# Altium schematic sheet drive-mp1907.SchDoc
size A3
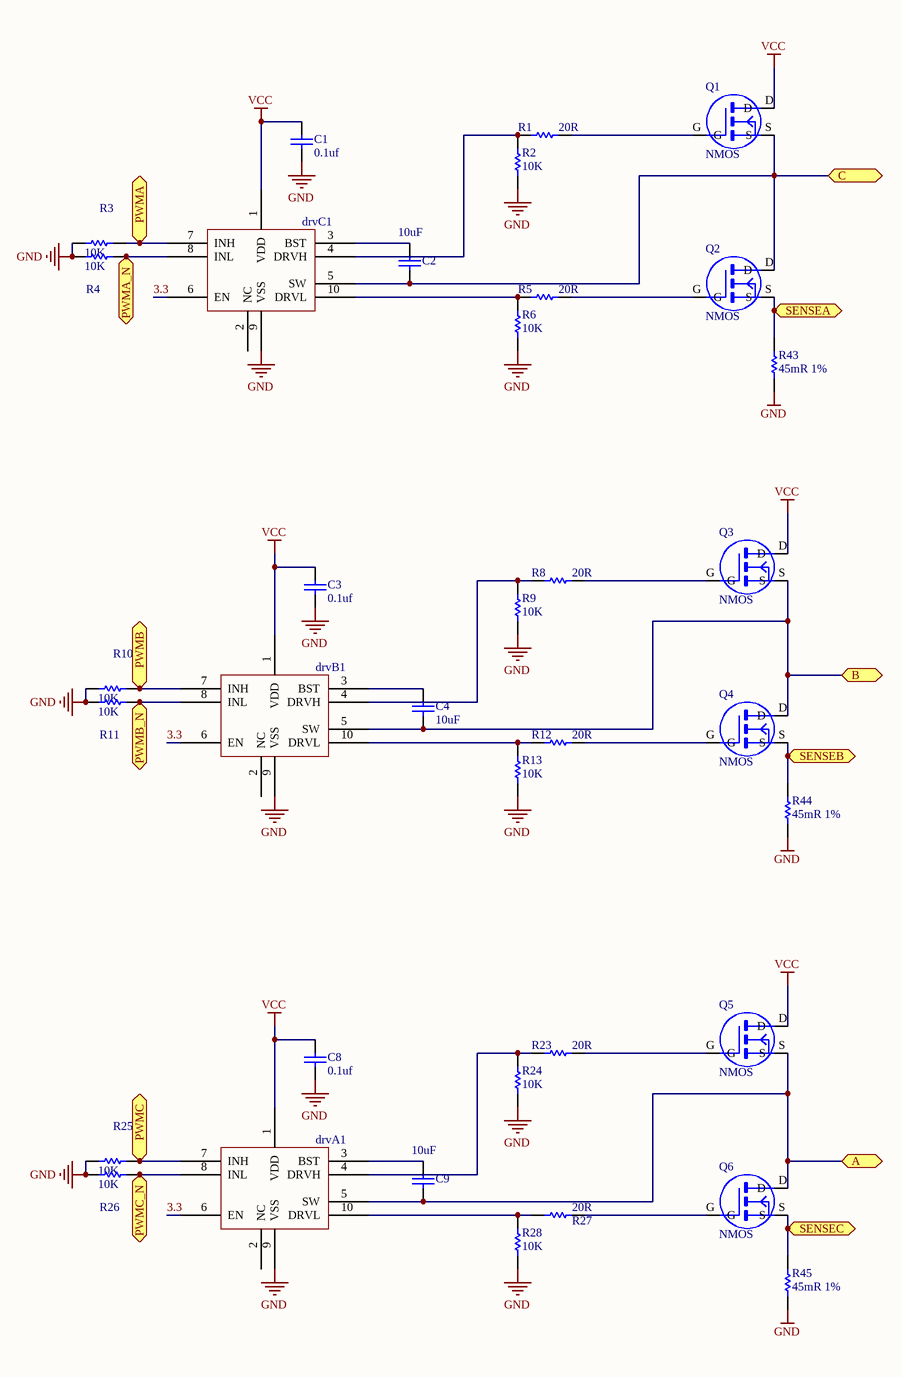
[diagram p0: drive-mp1907.SchDoc]

## Parts
C1  value 0.1uf  [0603]  (hidden comment: Cap)
C2  10uF  [0805]
C3  value 0.1uf  [0603]  (hidden comment: Cap)
C4  value 10uF  [0805]  (hidden comment: Cap)
C8  value 0.1uf  [0603]  (hidden comment: Cap)
C9  10uF  [0805]
drvA1  MP1907  [MP1907]  (value not drawn)
drvB1  MP1907  [MP1907]  (value not drawn)
drvC1  MP1907  [MP1907]  (value not drawn)
Q1  NMOS  [BSC025N03MS]
Q2  NMOS  [BSC025N03MS]
Q3  NMOS  [BSC025N03MS]
Q4  NMOS  [BSC025N03MS]
Q5  NMOS  [BSC025N03MS]
Q6  NMOS  [BSC025N03MS]
R1  value 20R  [0603]  (hidden comment: Res1)
R2  value 10K  [0603]  (hidden comment: Res1)
R3  value 10K  [0603]  (hidden comment: Res1)
R4  value 10K  [0603]  (hidden comment: Res1)
R5  value 20R  [0603]  (hidden comment: Res1)
R6  value 10K  [0603]  (hidden comment: Res1)
R8  value 20R  [0603]  (hidden comment: Res1)
R9  value 10K  [0603]  (hidden comment: Res1)
R10  value 10K  [0603]  (hidden comment: Res1)
R11  value 10K  [0603]  (hidden comment: Res1)
R12  value 20R  [0603]  (hidden comment: Res1)
R13  value 10K  [0603]  (hidden comment: Res1)
R23  value 20R  [0603]  (hidden comment: Res1)
R24  value 10K  [0603]  (hidden comment: Res1)
R25  value 10K  [0603]  (hidden comment: Res1)
R26  value 10K  [0603]  (hidden comment: Res1)
R27  value 20R  [0603]  (hidden comment: Res1)
R28  value 10K  [0603]  (hidden comment: Res1)
R43  45mR 1%  [2512]
R44  45mR 1%  [2512]
R45  45mR 1%  [2512]

## Ports
A, B, C, PWMA, PWMA_N, PWMB, PWMB_N, PWMC, PWMC_N, SENSEA, SENSEB, SENSEC

## Nets
GND: C1.2 C3.2 C8.2 drvA1.9(VSS) drvB1.9(VSS) drvC1.9(VSS) R2.2 R3.2 R4.2 R6.2 R9.2 R10.2 R11.2 R13.2 R24.2 R25.2 R26.2 R28.2 R43.1 R44.1 R45.1
VCC: C1.1 C3.1 C8.1 drvA1.1(VDD) drvB1.1(VDD) drvC1.1(VDD) Q1.D Q3.D Q5.D
3.3: drvA1.6(EN) drvB1.6(EN) drvC1.6(EN)
A: C9.1 drvA1.5(SW) Q5.S Q6.D ; port A
B: C4.1 drvB1.5(SW) Q3.S Q4.D ; port B
C: C2.1 drvC1.5(SW) Q1.S Q2.D ; port C
PWMA: drvC1.7(INH) R3.1 ; port PWMA
PWMA_N: drvC1.8(INL) R4.1 ; port PWMA_N
PWMB: drvB1.7(INH) R10.1 ; port PWMB
PWMB_N: drvB1.8(INL) R11.1 ; port PWMB_N
PWMC: drvA1.7(INH) R25.1 ; port PWMC
PWMC_N: drvA1.8(INL) R26.1 ; port PWMC_N
SENSEA: Q2.S R43.2 ; port SENSEA
SENSEB: Q4.S R44.2 ; port SENSEB
SENSEC: Q6.S R45.2 ; port SENSEC
NetC2_2: C2.2 drvC1.3(BST)
NetC4_2: C4.2 drvB1.3(BST)
NetC9_2: C9.2 drvA1.3(BST)
NetdrvA1_4: drvA1.4(DRVH) R23.2 R24.1
NetdrvA1_10: drvA1.10(DRVL) R27.2 R28.1
NetdrvB1_4: drvB1.4(DRVH) R8.2 R9.1
NetdrvB1_10: drvB1.10(DRVL) R12.2 R13.1
NetdrvC1_4: drvC1.4(DRVH) R1.2 R2.1
NetdrvC1_10: drvC1.10(DRVL) R5.2 R6.1
NetQ1_G: Q1.G R1.1
NetQ2_G: Q2.G R5.1
NetQ3_G: Q3.G R8.1
NetQ4_G: Q4.G R12.1
NetQ5_G: Q5.G R23.1
NetQ6_G: Q6.G R27.1

Not connected (* = marked no-connect by the designer): drvA1 2(NC); drvB1 2(NC); drvC1 2(NC)

## Library data of the parts
C1 C3 C4 C8 = Cap: Capacitor; Published: 8-Jun-2000; LatestRevisionDate: 17-Jul-2002; LatestRevisionNote: Re-released for DXP Platform.; PackageReference: RAD-0.3; Publisher: Altium Limited; PackageDescription: Radial Cap, Thru-Hole; 2 Leads; 0.3 in Pin Spacing
C2 C9 = Cap: Capacitor; Value: 0.1uf; Published: 8-Jun-2000; LatestRevisionDate: 17-Jul-2002; LatestRevisionNote: Re-released for DXP Platform.; PackageReference: RAD-0.3; Publisher: Altium Limited; PackageDescription: Radial Cap, Thru-Hole; 2 Leads; 0.3 in Pin Spacing
R1-R6 R8-R13 R23-R28 = Res1: Resistor; Published: 8-Jun-2000; LatestRevisionDate: 17-Jul-2002; LatestRevisionNote: Re-released for DXP Platform.; PackageReference: AXIAL-0.3; Publisher: Altium Limited; PackageDescription: Axial Device, Thru-Hole; 2 Leads; 0.3 in Pin Spacing
R43-R45 = Res1: Resistor; Value: 10K; Published: 8-Jun-2000; LatestRevisionDate: 17-Jul-2002; LatestRevisionNote: Re-released for DXP Platform.; PackageReference: AXIAL-0.3; Publisher: Altium Limited; PackageDescription: Axial Device, Thru-Hole; 2 Leads; 0.3 in Pin Spacing